# Altium schematic sheet Input and Safety.SchDoc
size A; SheetNumber: 2; SheetTotal: 9
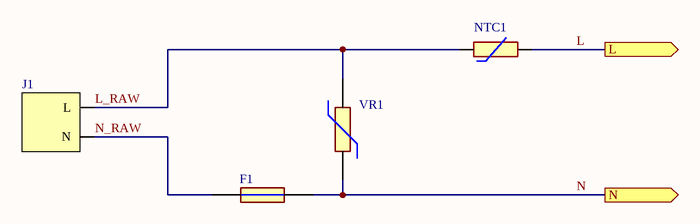
[diagram p0: Input and Safety.SchDoc]

## Parts
F1  250V 2.5A  [C310T-SC-2-5-R-TR1]  (value not drawn)
J1  250VAC  [691102710002]  (value not drawn)
NTC1  230V 2A  [B57153S0100M051]  (value not drawn)
VR1  275VAC  [B72307S0271K101]  (value not drawn)

## Ports
L (out), N (out)

## Nets
L: NTC1.2 ; port L
L_RAW: J1.1(L) NTC1.1 VR1.2
N: F1.2 VR1.1 ; port N
N_RAW: F1.1 J1.2(N)

## Library data of the parts
F1 = C310T-SC-2-5-R-TR1: Cartridge Fuses 2.5A 250V high I2t ceramic; Supplier 1: Mouser; Supplier Part Number 1: 504-C310T-SC25RTR1
J1 = 691102710002: Fixed Terminal Blocks WR-TBL 300VAC 15A 2P Straight; Supplier 1: Mouser; Supplier Part Number 1: 710-691102710002
NTC1 = B57153S0100M051: Inrush Current Limiters S 153/10 M51; Supplier 1: Mouser; Supplier Part Number 1: 871-B57153S0100M051
VR1 = B72307S0271K101: Varistors 7mm, 275Vac, 10%, Compact Series; Supplier 1: Mouser; Supplier Part Number 1: 871-B72307S0271K101